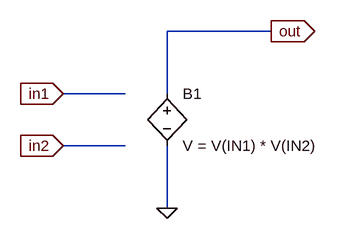
[diagram p0: schematic Multiplier.asc]
Multiplier.asc, the LTspice schematic file:
Version 4
SHEET 1 880 680
WIRE 640 32 480 32
WIRE 416 128 320 128
WIRE 480 128 480 32
WIRE 416 208 320 208
WIRE 480 304 480 208
FLAG 320 208 in2
IOPIN 320 208 In
FLAG 320 128 in1
IOPIN 320 128 In
FLAG 480 304 0
FLAG 640 32 out
IOPIN 640 32 Out
SYMBOL bv 480 112 R0
SYMATTR InstName B1
SYMATTR Value V = V(IN1) * V(IN2)

The netlist it stands for:
* Multiplier.asc
B1 out 0 V = V(IN1) * V(IN2)
.backanno
.end